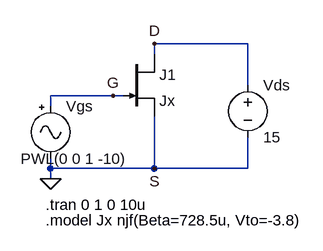
[diagram p0: schematic CircuitoSegundaParte.asc]
CircuitoSegundaParte.asc, the LTspice schematic file:
Version 4
SHEET 1 880 680
WIRE 384 96 240 96
WIRE 240 112 240 96
WIRE 384 160 384 96
WIRE 176 176 80 176
WIRE 192 176 176 176
WIRE 80 192 80 176
WIRE 80 288 80 272
WIRE 240 288 240 208
WIRE 240 288 80 288
WIRE 384 288 384 240
WIRE 384 288 240 288
WIRE 80 304 80 288
FLAG 80 304 0
FLAG 176 176 G
FLAG 240 96 D
FLAG 240 288 S
SYMBOL njf 192 112 R0
SYMATTR InstName J1
SYMATTR Value Jx
SYMBOL voltage 384 144 R0
WINDOW 123 0 0 Left 0
WINDOW 39 0 0 Left 0
SYMATTR InstName Vds
SYMATTR Value 15
SYMBOL Misc\\signal 80 176 R0
WINDOW 3 -46 97 Left 2
WINDOW 123 0 0 Left 0
WINDOW 39 0 0 Left 0
SYMATTR Value PWL(0 0 1 -10)
SYMATTR InstName Vgs
TEXT 72 344 Left 2 !.tran 0 1 0 10u
TEXT 72 368 Left 2 !.model Jx njf(Beta=728.5u, Vto=-3.8)

The netlist it stands for:
* CircuitoSegundaParte.asc
J1 D G 0 Jx
Vds D 0 15
Vgs G 0 PWL(0 0 1 -10)
.model NJF NJF
.model PJF PJF
.lib standard.jft
.tran 0 1 0 10u
.model Jx njf(Beta=728.5u, Vto=-3.8)
.backanno
.end

* Results of the author's LTspice run, read from the files saved beside the schematic
* Operating Point, zero values left out:
*   V(d) = 15 V
*   Id(J1) = 10.52 mA
*   Ig(J1) = -15.01 pA
*   Is(J1) = -10.52 mA
*   I(Vds) = -10.52 mA
*   I(Vgs) = 15.01 pA
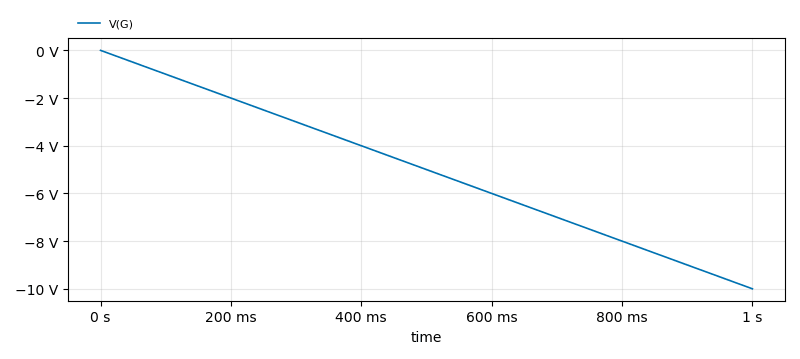
[diagram p1: Transient Analysis of CircuitoSegundaParte.asc, plotted from the saved traces]
* Transient Analysis, 1 run:
*   V(G): min -10 V, max 0 V, average -5 V, rms 5.774 V, last -10 V